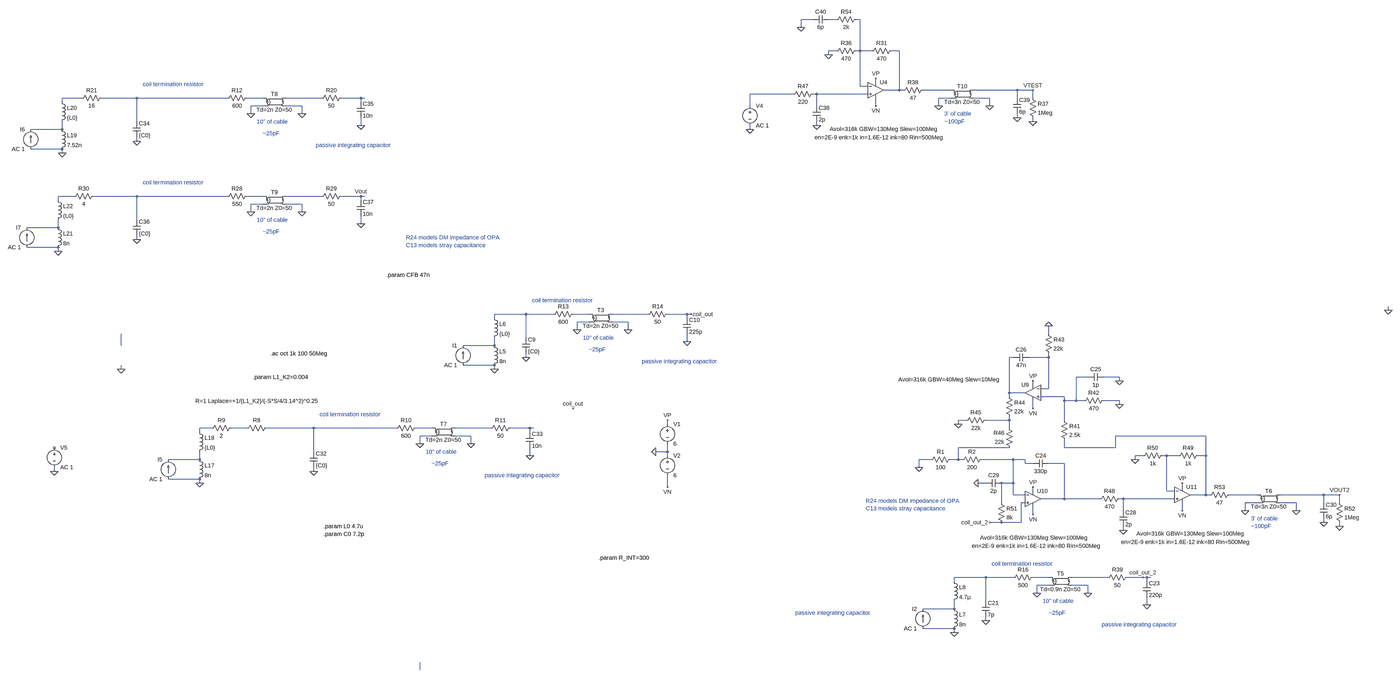
[diagram p0: schematic amp_sim_v3.asc, whole sheet]
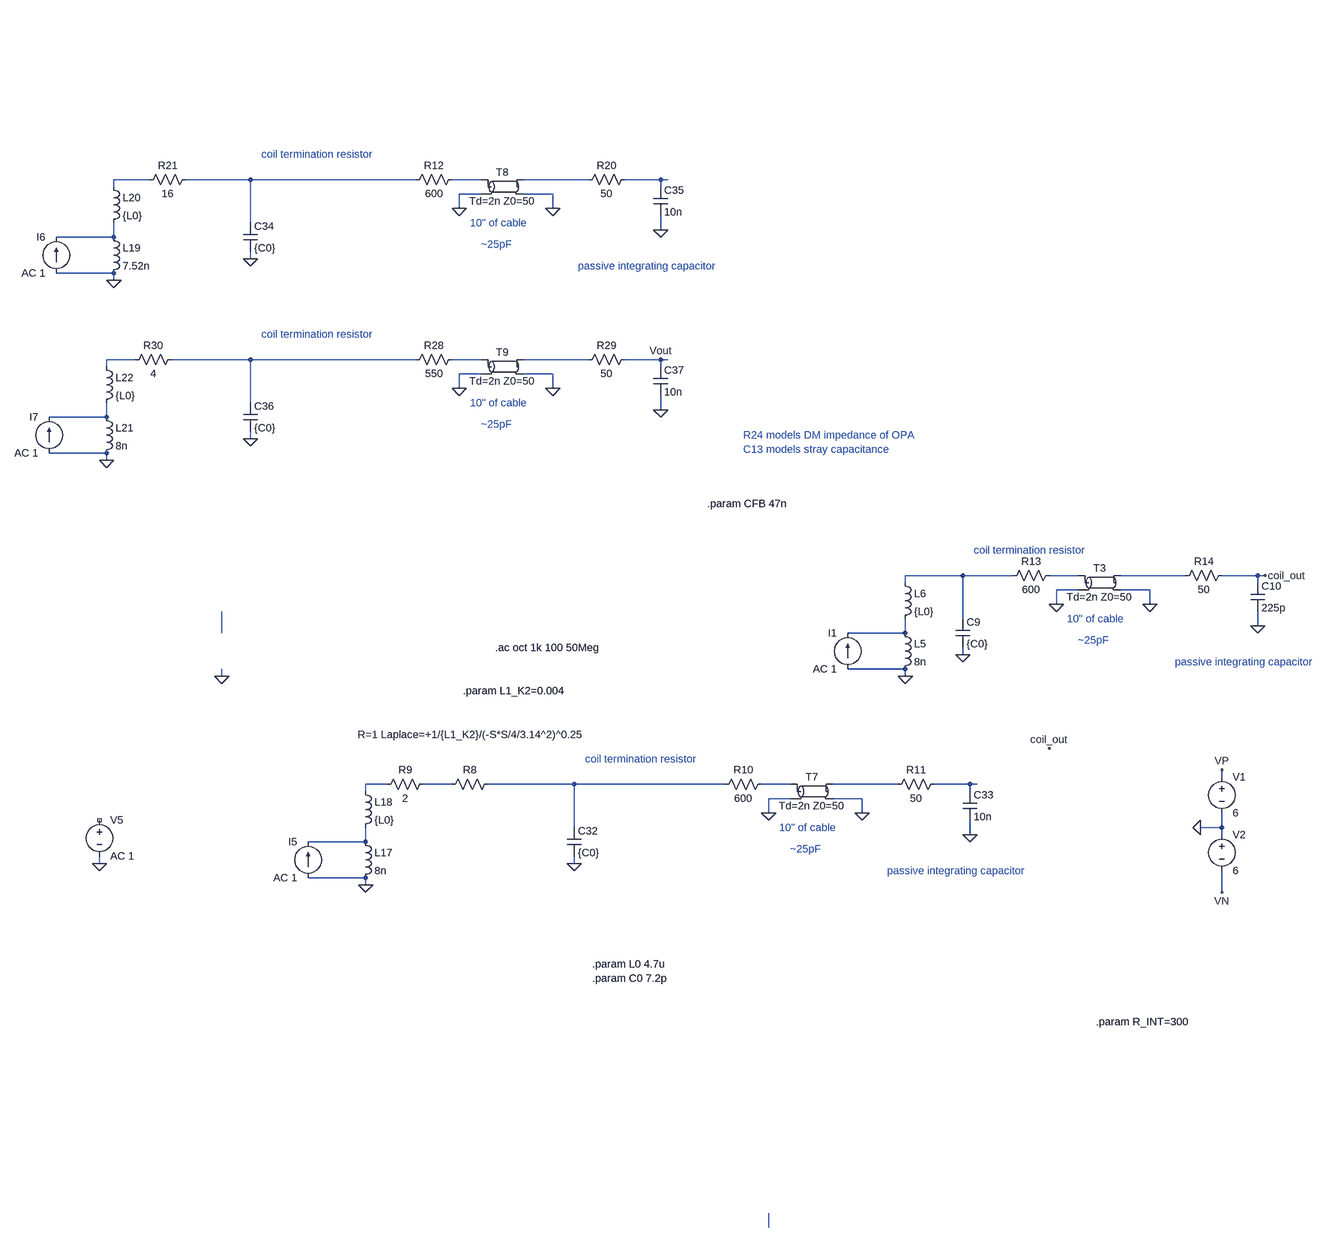
[diagram p1: schematic amp_sim_v3.asc, part, row 1 of 1, column 1 of 2]
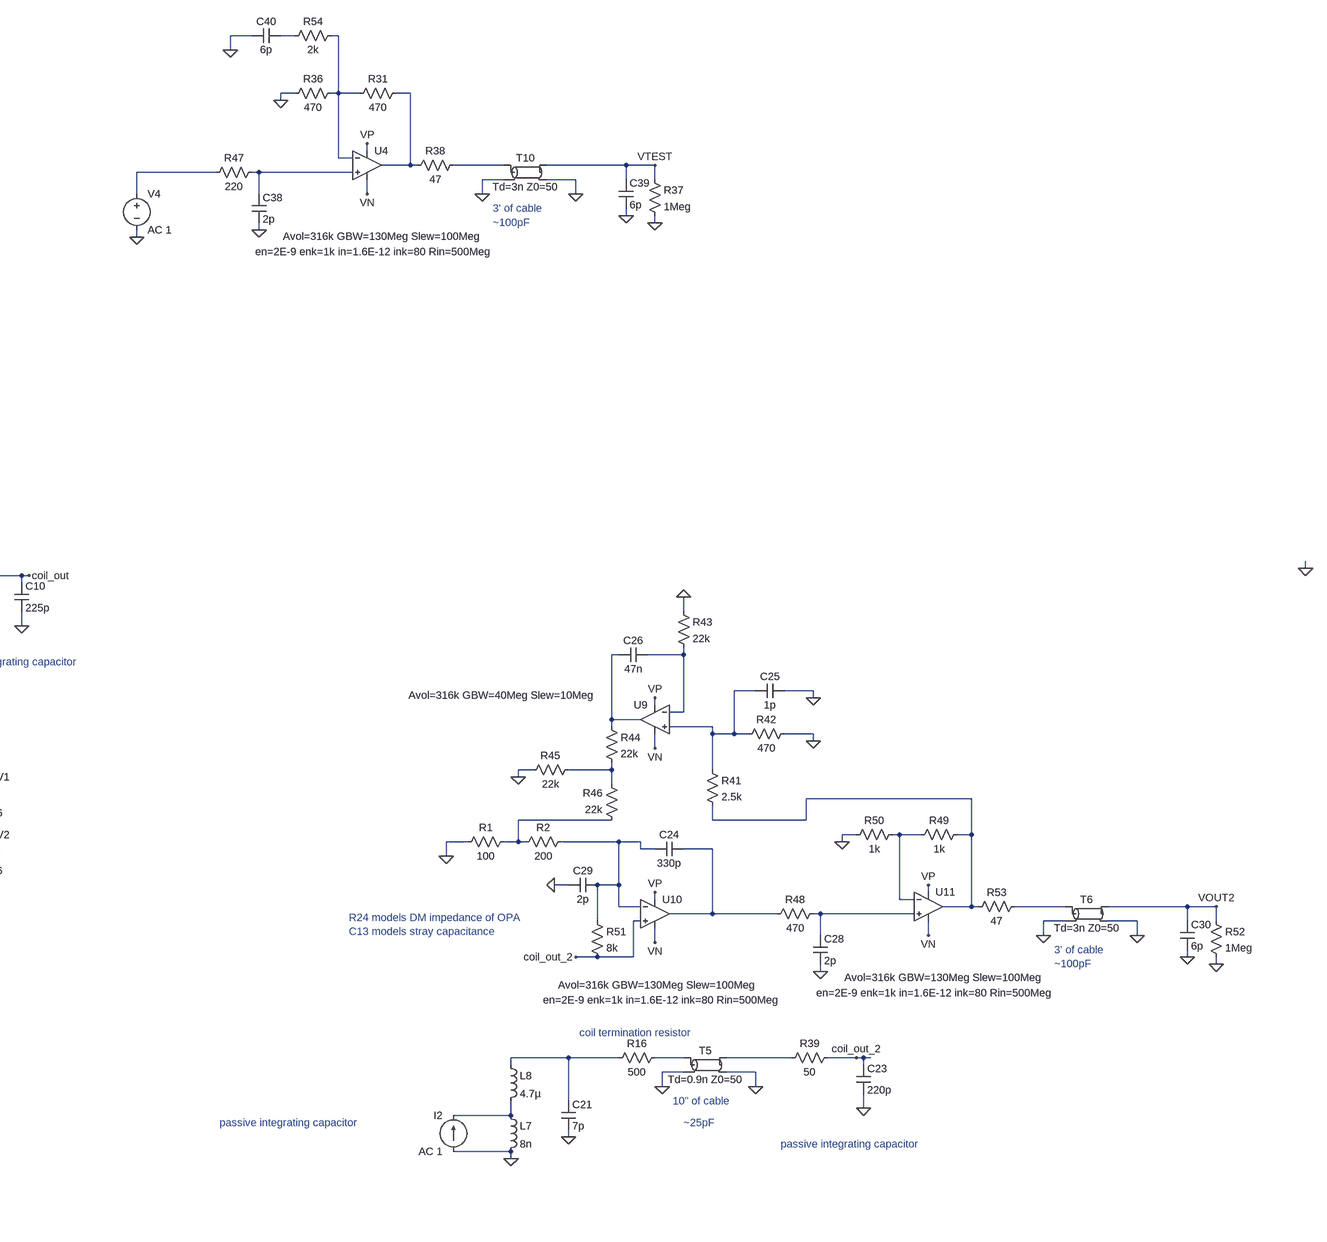
[diagram p2: schematic amp_sim_v3.asc, part, row 1 of 1, column 2 of 2]
amp_sim_v3.asc, the LTspice schematic file:
Version 4
SHEET 1 5332 1112
WIRE 2160 -2768 2112 -2768
WIRE 2256 -2768 2224 -2768
WIRE 2352 -2768 2336 -2768
WIRE 2112 -2736 2112 -2768
WIRE 2256 -2640 2224 -2640
WIRE 2352 -2640 2352 -2768
WIRE 2352 -2640 2336 -2640
WIRE 2400 -2640 2352 -2640
WIRE 2512 -2640 2480 -2640
WIRE 2224 -2624 2224 -2640
WIRE 2416 -2512 2416 -2528
WIRE 2352 -2496 2352 -2640
WIRE 2384 -2496 2352 -2496
WIRE 2512 -2480 2512 -2640
WIRE 2512 -2480 2448 -2480
WIRE 2528 -2480 2512 -2480
WIRE 2720 -2480 2608 -2480
WIRE 2992 -2480 2816 -2480
WIRE 3056 -2480 2992 -2480
WIRE 2080 -2464 1904 -2464
WIRE 2176 -2464 2160 -2464
WIRE 2384 -2464 2176 -2464
WIRE -864 -2448 -944 -2448
WIRE -640 -2448 -784 -2448
WIRE -272 -2448 -640 -2448
WIRE -128 -2448 -192 -2448
WIRE 112 -2448 -32 -2448
WIRE 272 -2448 192 -2448
WIRE 288 -2448 272 -2448
WIRE 2720 -2448 2672 -2448
WIRE 2880 -2448 2816 -2448
WIRE 2992 -2448 2992 -2480
WIRE 3056 -2448 3056 -2480
WIRE -944 -2432 -944 -2448
WIRE 272 -2432 272 -2448
WIRE -128 -2416 -176 -2416
WIRE 32 -2416 -32 -2416
WIRE 1904 -2416 1904 -2464
WIRE 2176 -2416 2176 -2464
WIRE 2416 -2416 2416 -2448
WIRE 2672 -2416 2672 -2448
WIRE 2880 -2416 2880 -2448
WIRE -176 -2384 -176 -2416
WIRE 32 -2384 32 -2416
WIRE 2992 -2368 2992 -2384
WIRE -640 -2352 -640 -2448
WIRE 3056 -2352 3056 -2368
WIRE 272 -2336 272 -2368
WIRE 2176 -2336 2176 -2352
WIRE -944 -2320 -944 -2352
WIRE -944 -2320 -1072 -2320
WIRE 1904 -2320 1904 -2336
WIRE -640 -2272 -640 -2288
WIRE -944 -2240 -1072 -2240
WIRE -944 -2224 -944 -2240
WIRE -896 -2048 -960 -2048
WIRE -640 -2048 -816 -2048
WIRE -272 -2048 -640 -2048
WIRE -128 -2048 -192 -2048
WIRE 112 -2048 -32 -2048
WIRE 272 -2048 192 -2048
WIRE 288 -2048 272 -2048
WIRE -960 -2032 -960 -2048
WIRE 272 -2032 272 -2048
WIRE -128 -2016 -176 -2016
WIRE 32 -2016 -32 -2016
WIRE -176 -1984 -176 -2016
WIRE 32 -1984 32 -2016
WIRE -640 -1952 -640 -2048
WIRE 272 -1936 272 -1968
WIRE -960 -1920 -960 -1952
WIRE -960 -1920 -1088 -1920
WIRE -640 -1872 -640 -1888
WIRE -960 -1840 -1088 -1840
WIRE -960 -1824 -960 -1840
WIRE 5136 -1584 5136 -1600
WIRE 944 -1568 816 -1568
WIRE 1056 -1568 944 -1568
WIRE 1200 -1568 1136 -1568
WIRE 1440 -1568 1296 -1568
WIRE 1600 -1568 1520 -1568
WIRE 1616 -1568 1600 -1568
WIRE 816 -1552 816 -1568
WIRE 1600 -1552 1600 -1568
WIRE 1200 -1536 1152 -1536
WIRE 1360 -1536 1296 -1536
WIRE 1152 -1504 1152 -1536
WIRE 1360 -1504 1360 -1536
WIRE 3120 -1488 3120 -1520
WIRE 944 -1472 944 -1568
WIRE 1600 -1456 1600 -1488
WIRE -704 -1440 -704 -1488
WIRE 816 -1440 816 -1472
WIRE 816 -1440 688 -1440
WIRE 944 -1392 944 -1408
WIRE 2976 -1392 2960 -1392
WIRE 3120 -1392 3120 -1408
WIRE 3120 -1392 3040 -1392
WIRE 816 -1360 688 -1360
WIRE -704 -1344 -704 -1360
WIRE 816 -1344 816 -1360
WIRE 3280 -1312 3232 -1312
WIRE 3408 -1312 3344 -1312
WIRE 3408 -1296 3408 -1312
WIRE 3056 -1280 3056 -1296
WIRE 3120 -1264 3120 -1392
WIRE 3120 -1264 3088 -1264
WIRE 2960 -1248 2960 -1392
WIRE 3024 -1248 2960 -1248
WIRE 2960 -1232 2960 -1248
WIRE 3184 -1232 3088 -1232
WIRE 3184 -1216 3184 -1232
WIRE 3232 -1216 3232 -1312
WIRE 3232 -1216 3184 -1216
WIRE 3264 -1216 3232 -1216
WIRE 3408 -1216 3344 -1216
WIRE 3408 -1200 3408 -1216
WIRE 3056 -1184 3056 -1216
WIRE 2784 -1136 2752 -1136
WIRE 2960 -1136 2960 -1152
WIRE 2960 -1136 2864 -1136
WIRE 3184 -1136 3184 -1216
WIRE 1520 -1120 1520 -1136
WIRE 2752 -1120 2752 -1136
WIRE -336 -1104 -384 -1104
WIRE -192 -1104 -256 -1104
WIRE 80 -1104 -112 -1104
WIRE 416 -1104 80 -1104
WIRE 560 -1104 496 -1104
WIRE 800 -1104 656 -1104
WIRE 960 -1104 880 -1104
WIRE 976 -1104 960 -1104
WIRE 2960 -1104 2960 -1136
WIRE -384 -1088 -384 -1104
WIRE 960 -1088 960 -1104
WIRE 560 -1072 512 -1072
WIRE 720 -1072 656 -1072
WIRE 3760 -1072 3392 -1072
WIRE 512 -1040 512 -1072
WIRE 720 -1040 720 -1072
WIRE 2960 -1024 2752 -1024
WIRE 3184 -1024 3184 -1056
WIRE 3392 -1024 3392 -1072
WIRE 3392 -1024 3184 -1024
WIRE 80 -1008 80 -1104
WIRE 1520 -1008 1520 -1040
WIRE 1520 -1008 1472 -1008
WIRE 960 -992 960 -1024
WIRE 1520 -992 1520 -1008
WIRE 3504 -992 3472 -992
WIRE 3600 -992 3584 -992
WIRE 3648 -992 3600 -992
WIRE 3760 -992 3760 -1072
WIRE 3760 -992 3728 -992
WIRE -384 -976 -384 -1008
WIRE -384 -976 -512 -976
WIRE 2640 -976 2592 -976
WIRE 2752 -976 2752 -1024
WIRE 2752 -976 2720 -976
WIRE 2768 -976 2752 -976
WIRE 2976 -976 2848 -976
WIRE 3024 -976 2976 -976
WIRE 3472 -976 3472 -992
WIRE 3024 -960 3024 -976
WIRE 3056 -960 3024 -960
WIRE 3184 -960 3120 -960
WIRE 2592 -944 2592 -976
WIRE -976 -928 -976 -944
WIRE 80 -928 80 -944
WIRE -384 -896 -512 -896
WIRE -384 -880 -384 -896
WIRE 2864 -880 2832 -880
WIRE 2976 -880 2976 -976
WIRE 2976 -880 2928 -880
WIRE 1520 -864 1520 -912
WIRE 3664 -864 3664 -880
WIRE 3056 -848 3056 -864
WIRE 3600 -848 3600 -992
WIRE 3632 -848 3600 -848
WIRE 2976 -832 2976 -880
WIRE 3024 -832 2976 -832
WIRE 3760 -832 3760 -992
WIRE 3760 -832 3696 -832
WIRE 3776 -832 3760 -832
WIRE 3968 -832 3856 -832
WIRE 4240 -832 4064 -832
WIRE 4304 -832 4240 -832
WIRE 3184 -816 3184 -960
WIRE 3184 -816 3088 -816
WIRE 3328 -816 3184 -816
WIRE 3424 -816 3408 -816
WIRE 3632 -816 3424 -816
WIRE 2928 -800 2928 -880
WIRE 3024 -800 3008 -800
WIRE 3968 -800 3920 -800
WIRE 4128 -800 4064 -800
WIRE 4240 -800 4240 -832
WIRE 4304 -800 4304 -832
WIRE 3424 -768 3424 -816
WIRE 3664 -768 3664 -800
WIRE 3920 -768 3920 -800
WIRE 4128 -768 4128 -800
WIRE 3056 -752 3056 -784
WIRE 2928 -720 2880 -720
WIRE 3008 -720 3008 -800
WIRE 3008 -720 2928 -720
WIRE 4240 -720 4240 -736
WIRE 4304 -704 4304 -720
WIRE 3424 -688 3424 -704
WIRE 2864 -496 2736 -496
WIRE 2976 -496 2864 -496
WIRE 3120 -496 3056 -496
WIRE 3360 -496 3216 -496
WIRE 3504 -496 3440 -496
WIRE 3520 -496 3504 -496
WIRE 3536 -496 3520 -496
WIRE 2736 -480 2736 -496
WIRE 3520 -480 3520 -496
WIRE 3120 -464 3072 -464
WIRE 3280 -464 3216 -464
WIRE 3072 -432 3072 -464
WIRE 3280 -432 3280 -464
WIRE 2864 -400 2864 -496
WIRE 3520 -384 3520 -416
WIRE 2736 -368 2736 -400
WIRE 2736 -368 2608 -368
WIRE 2864 -320 2864 -336
WIRE 2736 -288 2608 -288
WIRE 2736 -272 2736 -288
WIRE 512 400 512 368
FLAG 1472 -1008 0
FLAG 1520 -1136 VP
FLAG 1520 -864 VN
FLAG 944 -1392 0
FLAG 816 -1344 0
FLAG 1152 -1504 0
FLAG 1360 -1504 0
FLAG 1600 -1456 0
FLAG 1616 -1568 coil_out
FLAG 2864 -320 0
FLAG 2736 -272 0
FLAG 3072 -432 0
FLAG 3280 -432 0
FLAG 3520 -384 0
FLAG 3504 -496 coil_out_2
FLAG 3056 -864 VP
FLAG 3056 -752 VN
FLAG 3056 -1296 VP
FLAG 3056 -1184 VN
FLAG 3408 -1200 0
FLAG 3408 -1296 0
FLAG 3120 -1520 0
FLAG 2752 -1120 0
FLAG 3664 -880 VP
FLAG 3664 -768 VN
FLAG 3424 -688 0
FLAG 3472 -976 0
FLAG 4304 -832 VOUT2
FLAG 2880 -720 coil_out_2
FLAG 2832 -880 0
FLAG 3920 -768 0
FLAG 4128 -768 0
FLAG 4240 -720 0
FLAG 4304 -704 0
FLAG 5136 -1584 0
FLAG 80 -928 0
FLAG -384 -880 0
FLAG 512 -1040 0
FLAG 720 -1040 0
FLAG 960 -992 0
FLAG 1136 -1184 coil_out
FLAG -640 -2272 0
FLAG -944 -2224 0
FLAG -176 -2384 0
FLAG 32 -2384 0
FLAG 272 -2336 0
FLAG -640 -1872 0
FLAG -960 -1824 0
FLAG -176 -1984 0
FLAG 32 -1984 0
FLAG 272 -1936 0
FLAG 272 -2048 Vout
FLAG 2416 -2528 VP
FLAG 2416 -2416 VN
FLAG 2176 -2336 0
FLAG 2224 -2624 0
FLAG 3056 -2480 VTEST
FLAG 2672 -2416 0
FLAG 2880 -2416 0
FLAG 2992 -2368 0
FLAG 3056 -2352 0
FLAG 1904 -2320 0
FLAG 2112 -2736 0
FLAG -704 -1344 0
FLAG -976 -928 0
FLAG 2592 -944 0
SYMBOL voltage 1520 -1136 R0
WINDOW 123 0 0 Left 0
WINDOW 39 0 0 Left 0
SYMATTR InstName V1
SYMATTR Value 6
SYMBOL voltage 1520 -1008 R0
WINDOW 123 0 0 Left 0
WINDOW 39 0 0 Left 0
SYMATTR InstName V2
SYMATTR Value 6
SYMBOL ind 800 -1456 R0
SYMATTR InstName L5
SYMATTR Value 8n
SYMATTR SpiceLine Rser=0
SYMBOL ind 800 -1568 R0
SYMATTR InstName L6
SYMATTR Value {L0}
SYMBOL cap 928 -1472 R0
SYMATTR InstName C9
SYMATTR Value {C0}
SYMBOL res 1152 -1584 R90
WINDOW 0 0 56 VBottom 2
WINDOW 3 32 56 VTop 2
SYMATTR InstName R13
SYMATTR Value 600
SYMBOL res 1536 -1584 R90
WINDOW 0 0 56 VBottom 2
WINDOW 3 32 56 VTop 2
SYMATTR InstName R14
SYMATTR Value 50
SYMBOL tline 1248 -1552 R0
SYMATTR InstName T3
SYMATTR Value Td=2n Z0=50
SYMBOL cap 1584 -1552 R0
SYMATTR InstName C10
SYMATTR Value 225p
SYMBOL ind 2720 -384 R0
SYMATTR InstName L7
SYMATTR Value 8n
SYMATTR SpiceLine Rser=0
SYMBOL ind 2720 -496 R0
SYMATTR InstName L8
SYMATTR Value 4.7µ
SYMBOL cap 2848 -400 R0
SYMATTR InstName C21
SYMATTR Value 7p
SYMBOL res 3072 -512 R90
WINDOW 0 0 56 VBottom 2
WINDOW 3 32 56 VTop 2
SYMATTR InstName R16
SYMATTR Value 500
SYMBOL res 3456 -512 R90
WINDOW 0 0 56 VBottom 2
WINDOW 3 32 56 VTop 2
SYMATTR InstName R39
SYMATTR Value 50
SYMBOL tline 3168 -480 R0
SYMATTR InstName T5
SYMATTR Value Td=0.9n Z0=50
SYMBOL cap 3504 -480 R0
SYMATTR InstName C23
SYMATTR Value 220p
SYMBOL cap 3120 -976 R90
WINDOW 0 0 32 VBottom 2
WINDOW 3 32 32 VTop 2
SYMATTR InstName C24
SYMATTR Value 330p
SYMBOL res 3168 -1152 R0
SYMATTR InstName R41
SYMATTR Value 2.5k
SYMBOL res 3360 -1232 R90
WINDOW 0 0 56 VBottom 2
WINDOW 3 32 56 VTop 2
SYMATTR InstName R42
SYMATTR Value 470
SYMBOL cap 3344 -1328 R90
WINDOW 0 0 32 VBottom 2
WINDOW 3 32 32 VTop 2
SYMATTR InstName C25
SYMATTR Value 1p
SYMBOL res 3104 -1504 R0
SYMATTR InstName R43
SYMATTR Value 22k
SYMBOL cap 3040 -1408 R90
WINDOW 0 0 32 VBottom 2
WINDOW 3 32 32 VTop 2
SYMATTR InstName C26
SYMATTR Value 47n
SYMBOL res 2944 -1248 R0
SYMATTR InstName R44
SYMATTR Value 22k
SYMBOL res 2880 -1152 R90
WINDOW 0 0 56 VBottom 2
WINDOW 3 32 56 VTop 2
SYMATTR InstName R45
SYMATTR Value 22k
SYMBOL res 2976 -1008 R180
WINDOW 0 36 76 Left 2
WINDOW 3 36 40 Left 2
SYMATTR InstName R46
SYMATTR Value 22k
SYMBOL res 3424 -832 R90
WINDOW 0 0 56 VBottom 2
WINDOW 3 32 56 VTop 2
SYMATTR InstName R48
SYMATTR Value 470
SYMBOL cap 3408 -768 R0
SYMATTR InstName C28
SYMATTR Value 2p
SYMBOL res 3744 -1008 R90
WINDOW 0 0 56 VBottom 2
WINDOW 3 32 56 VTop 2
SYMATTR InstName R49
SYMATTR Value 1k
SYMBOL res 3600 -1008 R90
WINDOW 0 0 56 VBottom 2
WINDOW 3 32 56 VTop 2
SYMATTR InstName R50
SYMATTR Value 1k
SYMBOL OpAmps\\UniversalOpamp2 3056 -1248 M0
WINDOW 123 135 -54 Left 2
SYMATTR Value2 Avol=316k GBW=40Meg Slew=10Meg
SYMATTR InstName U9
SYMATTR SpiceLine2 en=1E-9 enk=25 in=0.04E-12 ink=2k Rin=500Meg
SYMBOL cap 2928 -896 R90
WINDOW 0 0 32 VBottom 2
WINDOW 3 32 32 VTop 2
SYMATTR InstName C29
SYMATTR Value 2p
SYMBOL res 2912 -816 R0
SYMATTR InstName R51
SYMATTR Value 8k
SYMBOL OpAmps\\UniversalOpamp2 3056 -816 R0
WINDOW 123 -215 158 Left 2
WINDOW 40 -249 192 Left 2
SYMATTR Value2 Avol=316k GBW=130Meg Slew=100Meg
SYMATTR SpiceLine2 en=2E-9 enk=1k in=1.6E-12 ink=80 Rin=500Meg
SYMATTR InstName U10
SYMATTR SpiceLine ilimit=80m rail=0 Vos=0 phimargin=45
SYMBOL tline 4016 -816 R0
SYMATTR InstName T6
SYMATTR Value Td=3n Z0=50
SYMBOL res 4288 -816 R0
SYMATTR InstName R52
SYMATTR Value 1Meg
SYMBOL cap 4224 -800 R0
SYMATTR InstName C30
SYMATTR Value 6p
SYMBOL res 3872 -848 R90
WINDOW 0 0 56 VBottom 2
WINDOW 3 32 56 VTop 2
SYMATTR InstName R53
SYMATTR Value 47
SYMBOL OpAmps\\UniversalOpamp2 3664 -832 R0
WINDOW 123 -187 158 Left 2
WINDOW 40 -249 192 Left 2
SYMATTR Value2 Avol=316k GBW=130Meg Slew=100Meg
SYMATTR SpiceLine2 en=2E-9 enk=1k in=1.6E-12 ink=80 Rin=500Meg
SYMATTR InstName U11
SYMATTR SpiceLine ilimit=80m rail=0 Vos=0 phimargin=45
SYMBOL current 688 -1360 R180
WINDOW 0 24 80 Left 2
WINDOW 3 24 0 Left 2
WINDOW 123 0 0 Left 0
WINDOW 39 0 0 Left 0
SYMATTR InstName I1
SYMATTR Value AC 1
SYMBOL current 2608 -288 R180
WINDOW 0 24 80 Left 2
WINDOW 3 24 0 Left 2
WINDOW 123 0 0 Left 0
WINDOW 39 0 0 Left 0
SYMATTR InstName I2
SYMATTR Value AC 1
SYMBOL res -96 -1120 R90
WINDOW 0 0 56 VBottom 2
WINDOW 3 -110 55 VTop 2
SYMATTR InstName R8
SYMATTR Value R=1 Laplace=+1/{L1_K2}/(-S*S/4/3.14^2)^0.25
SYMBOL res -240 -1120 R90
WINDOW 0 0 56 VBottom 2
WINDOW 3 32 56 VTop 2
SYMATTR InstName R9
SYMATTR Value 2
SYMBOL ind -400 -992 R0
SYMATTR InstName L17
SYMATTR Value 8n
SYMATTR SpiceLine Rser=0
SYMBOL ind -400 -1104 R0
SYMATTR InstName L18
SYMATTR Value {L0}
SYMBOL cap 64 -1008 R0
SYMATTR InstName C32
SYMATTR Value {C0}
SYMBOL res 512 -1120 R90
WINDOW 0 0 56 VBottom 2
WINDOW 3 32 56 VTop 2
SYMATTR InstName R10
SYMATTR Value 600
SYMBOL res 896 -1120 R90
WINDOW 0 0 56 VBottom 2
WINDOW 3 32 56 VTop 2
SYMATTR InstName R11
SYMATTR Value 50
SYMBOL tline 608 -1088 R0
SYMATTR InstName T7
SYMATTR Value Td=2n Z0=50
SYMBOL cap 944 -1088 R0
SYMATTR InstName C33
SYMATTR Value 10n
SYMBOL current -512 -896 R180
WINDOW 0 24 80 Left 2
WINDOW 3 24 0 Left 2
WINDOW 123 0 0 Left 0
WINDOW 39 0 0 Left 0
SYMATTR InstName I5
SYMATTR Value AC 1
SYMBOL ind -960 -2336 R0
SYMATTR InstName L19
SYMATTR Value 7.52n
SYMATTR SpiceLine Rser=0
SYMBOL ind -960 -2448 R0
SYMATTR InstName L20
SYMATTR Value {L0}
SYMBOL cap -656 -2352 R0
SYMATTR InstName C34
SYMATTR Value {C0}
SYMBOL res -176 -2464 R90
WINDOW 0 0 56 VBottom 2
WINDOW 3 32 56 VTop 2
SYMATTR InstName R12
SYMATTR Value 600
SYMBOL res 208 -2464 R90
WINDOW 0 0 56 VBottom 2
WINDOW 3 32 56 VTop 2
SYMATTR InstName R20
SYMATTR Value 50
SYMBOL tline -80 -2432 R0
SYMATTR InstName T8
SYMATTR Value Td=2n Z0=50
SYMBOL cap 256 -2432 R0
SYMATTR InstName C35
SYMATTR Value 10n
SYMBOL current -1072 -2240 R180
WINDOW 0 24 80 Left 2
WINDOW 3 24 0 Left 2
WINDOW 123 0 0 Left 0
WINDOW 39 0 0 Left 0
SYMATTR InstName I6
SYMATTR Value AC 1
SYMBOL res -768 -2464 R90
WINDOW 0 0 56 VBottom 2
WINDOW 3 32 56 VTop 2
SYMATTR InstName R21
SYMATTR Value 16
SYMBOL ind -976 -1936 R0
SYMATTR InstName L21
SYMATTR Value 8n
SYMATTR SpiceLine Rser=0
SYMBOL ind -976 -2048 R0
SYMATTR InstName L22
SYMATTR Value {L0}
SYMBOL cap -656 -1952 R0
SYMATTR InstName C36
SYMATTR Value {C0}
SYMBOL res -176 -2064 R90
WINDOW 0 0 56 VBottom 2
WINDOW 3 32 56 VTop 2
SYMATTR InstName R28
SYMATTR Value 550
SYMBOL res 208 -2064 R90
WINDOW 0 0 56 VBottom 2
WINDOW 3 32 56 VTop 2
SYMATTR InstName R29
SYMATTR Value 50
SYMBOL tline -80 -2032 R0
SYMATTR InstName T9
SYMATTR Value Td=2n Z0=50
SYMBOL cap 256 -2032 R0
SYMATTR InstName C37
SYMATTR Value 10n
SYMBOL current -1088 -1840 R180
WINDOW 0 24 80 Left 2
WINDOW 3 24 0 Left 2
WINDOW 123 0 0 Left 0
WINDOW 39 0 0 Left 0
SYMATTR InstName I7
SYMATTR Value AC 1
SYMBOL res -800 -2064 R90
WINDOW 0 0 56 VBottom 2
WINDOW 3 32 56 VTop 2
SYMATTR InstName R30
SYMATTR Value 4
SYMBOL cap 2160 -2416 R0
SYMATTR InstName C38
SYMATTR Value 2p
SYMBOL res 2496 -2656 R90
WINDOW 0 0 56 VBottom 2
WINDOW 3 32 56 VTop 2
SYMATTR InstName R31
SYMATTR Value 470
SYMBOL res 2352 -2656 R90
WINDOW 0 0 56 VBottom 2
WINDOW 3 32 56 VTop 2
SYMATTR InstName R36
SYMATTR Value 470
SYMBOL tline 2768 -2464 R0
SYMATTR InstName T10
SYMATTR Value Td=3n Z0=50
SYMBOL res 3040 -2464 R0
SYMATTR InstName R37
SYMATTR Value 1Meg
SYMBOL cap 2976 -2448 R0
SYMATTR InstName C39
SYMATTR Value 6p
SYMBOL res 2624 -2496 R90
WINDOW 0 0 56 VBottom 2
WINDOW 3 32 56 VTop 2
SYMATTR InstName R38
SYMATTR Value 47
SYMBOL OpAmps\\UniversalOpamp2 2416 -2480 R0
WINDOW 123 -187 158 Left 2
WINDOW 40 -249 192 Left 2
SYMATTR Value2 Avol=316k GBW=130Meg Slew=100Meg
SYMATTR SpiceLine2 en=2E-9 enk=1k in=1.6E-12 ink=80 Rin=500Meg
SYMATTR InstName U4
SYMATTR SpiceLine ilimit=80m rail=0 Vos=0 phimargin=45
SYMBOL res 2176 -2480 R90
WINDOW 0 0 56 VBottom 2
WINDOW 3 32 56 VTop 2
SYMATTR InstName R47
SYMATTR Value 220
SYMBOL voltage 1904 -2432 R0
WINDOW 123 0 0 Left 0
WINDOW 39 0 0 Left 0
SYMATTR InstName V4
SYMATTR Value AC 1
SYMBOL res 2352 -2784 R90
WINDOW 0 0 56 VBottom 2
WINDOW 3 32 56 VTop 2
SYMATTR InstName R54
SYMATTR Value 2k
SYMBOL cap 2224 -2784 R90
WINDOW 0 0 32 VBottom 2
WINDOW 3 32 32 VTop 2
SYMATTR InstName C40
SYMATTR Value 6p
SYMBOL voltage -976 -1040 R0
WINDOW 123 0 0 Left 0
WINDOW 39 0 0 Left 0
SYMATTR InstName V5
SYMATTR Value AC 1
SYMBOL res 2736 -992 R90
WINDOW 0 0 56 VBottom 2
WINDOW 3 32 56 VTop 2
SYMATTR InstName R1
SYMATTR Value 100
SYMBOL res 2864 -992 R90
WINDOW 0 0 56 VBottom 2
WINDOW 3 32 56 VTop 2
SYMATTR InstName R2
SYMATTR Value 200
TEXT -96 -1408 Left 2 !.ac oct 1k 100 50Meg
TEXT 1176 -1472 Left 2 ;10" of cable
TEXT 968 -1624 Left 2 ;coil termination resistor
TEXT 1416 -1376 Left 2 ;passive integrating capacitor
TEXT 1200 -1424 Left 2 ;~25pF
TEXT 456 -1880 Left 2 ;R24 models DM impedance of OPA\nC13 models stray capacitance
TEXT 376 -1728 Left 2 !.param CFB 47n
TEXT 3096 -400 Left 2 ;10" of cable
TEXT 2888 -552 Left 2 ;coil termination resistor
TEXT 3336 -304 Left 2 ;passive integrating capacitor
TEXT 3120 -352 Left 2 ;~25pF
TEXT 2376 -808 Left 2 ;R24 models DM impedance of OPA\nC13 models stray capacitance
TEXT 3944 -736 Left 2 ;3' of cable\n~100pF
TEXT 120 -704 Left 2 !.param L0 4.7u\n.param C0 7.2p
TEXT 2088 -352 Left 2 ;passive integrating capacitor
TEXT -168 -1312 Left 2 !.param L1_K2=0.004
TEXT 536 -1008 Left 2 ;10" of cable
TEXT 104 -1160 Left 2 ;coil termination resistor
TEXT 776 -912 Left 2 ;passive integrating capacitor
TEXT 560 -960 Left 2 ;~25pF
TEXT -152 -2352 Left 2 ;10" of cable
TEXT -616 -2504 Left 2 ;coil termination resistor
TEXT 88 -2256 Left 2 ;passive integrating capacitor
TEXT -128 -2304 Left 2 ;~25pF
TEXT -152 -1952 Left 2 ;10" of cable
TEXT -616 -2104 Left 2 ;coil termination resistor
TEXT -128 -1904 Left 2 ;~25pF
TEXT 2696 -2384 Left 2 ;3' of cable\n~100pF
TEXT 1240 -576 Left 2 !.param R_INT=300

The netlist it stands for:
* amp_sim_v3.asc
V1 VP 0 6
V2 0 VN 6
L5 N022 0 8n Rser=0
L6 N018 N022 {L0}
C9 N018 0 {C0}
R13 N019 N018 600
R14 coil_out N020 50
T3 N019 0 N020 0 Td=2n Z0=50
C10 coil_out 0 225p
L7 N044 0 8n Rser=0
L8 N041 N044 4.7µ
C21 N041 0 7p
R16 N042 N041 500
R39 coil_out_2 N043 50
T5 N042 0 N043 0 Td=0.9n Z0=50
C23 coil_out_2 0 220p
C24 N038 N037 330p
R41 N025 N033 2.5k
R42 0 N025 470
C25 0 N025 1p
R43 0 N024 22k
C26 N024 N023 47n
R44 N023 N026 22k
R45 N026 0 22k
R46 N034 N026 22k
R48 N040 N038 470
C28 N040 0 2p
R49 N033 N035 1k
R50 N035 0 1k
XU9 N025 N024 VP VN N023 level.2 Avol=316k GBW=40Meg Slew=10Meg ilimit=25m rail=0 Vos=0 phimargin=45 en=1E-9 enk=25 in=0.04E-12 ink=2k Rin=500Meg  ; pins IN+ IN- V+ V- OUT
C29 N037 0 2p
R51 N037 coil_out_2 8k
XU10 coil_out_2 N037 VP VN N038 level.2 Avol=316k GBW=130Meg Slew=100Meg ilimit=80m rail=0 Vos=0 phimargin=45 en=2E-9 enk=1k in=1.6E-12 ink=80 Rin=500Meg  ; pins IN+ IN- V+ V- OUT
T6 N039 0 VOUT2 0 Td=3n Z0=50
R52 VOUT2 0 1Meg
C30 VOUT2 0 6p
R53 N039 N033 47
XU11 N040 N035 VP VN N033 level.2 Avol=316k GBW=130Meg Slew=100Meg ilimit=80m rail=0 Vos=0 phimargin=45 en=2E-9 enk=1k in=1.6E-12 ink=80 Rin=500Meg  ; pins IN+ IN- V+ V- OUT
I1 0 N022 AC 1
I2 0 N044 AC 1
R8 N029 N028 R=1 Laplace=+1/{L1_K2}/(-S*S/4/3.14^2)^0.25
R9 N028 N027 2
L17 N036 0 8n Rser=0
L18 N027 N036 {L0}
C32 N029 0 {C0}
R10 N030 N029 600
R11 N032 N031 50
T7 N030 0 N031 0 Td=2n Z0=50
C33 N032 0 10n
I5 0 N036 AC 1
L19 N012 0 7.52n Rser=0
L20 N007 N012 {L0}
C34 N008 0 {C0}
R12 N009 N008 600
R20 N011 N010 50
T8 N009 0 N010 0 Td=2n Z0=50
C35 N011 0 10n
I6 0 N012 AC 1
R21 N008 N007 16
L21 N017 0 8n Rser=0
L22 N013 N017 {L0}
C36 N014 0 {C0}
R28 N015 N014 550
R29 Vout N016 50
T9 N015 0 N016 0 Td=2n Z0=50
C37 Vout 0 10n
I7 0 N017 AC 1
R30 N014 N013 4
C38 N006 0 2p
R31 N003 N002 470
R36 N002 0 470
T10 N004 0 VTEST 0 Td=3n Z0=50
R37 VTEST 0 1Meg
C39 VTEST 0 6p
R38 N004 N003 47
XU4 N006 N002 VP VN N003 level.2 Avol=316k GBW=130Meg Slew=100Meg ilimit=80m rail=0 Vos=0 phimargin=45 en=2E-9 enk=1k in=1.6E-12 ink=80 Rin=500Meg  ; pins IN+ IN- V+ V- OUT
R47 N006 N005 220
V4 N005 0 AC 1
R54 N002 N001 2k
C40 N001 0 6p
V5 NC_01 0 AC 1
R1 N034 0 100
R2 N037 N034 200
.ac oct 1k 100 50Meg
* 10" of cable
* coil termination resistor
* passive integrating capacitor
* ~25pF
* R24 models DM impedance of OPA
* C13 models stray capacitance
.param CFB 47n
* 10" of cable
* coil termination resistor
* passive integrating capacitor
* ~25pF
* R24 models DM impedance of OPA
* C13 models stray capacitance
* 3' of cable
* ~100pF
.param L0 4.7u
.param C0 7.2p
* passive integrating capacitor
.param L1_K2=0.004
* 10" of cable
* coil termination resistor
* passive integrating capacitor
* ~25pF
* 10" of cable
* coil termination resistor
* passive integrating capacitor
* ~25pF
* 10" of cable
* coil termination resistor
* ~25pF
* 3' of cable
* ~100pF
.param R_INT=300
.lib UniversalOpamps2.sub
.backanno
.end